# EAGLE design Main (EAGLE 7.4.0)
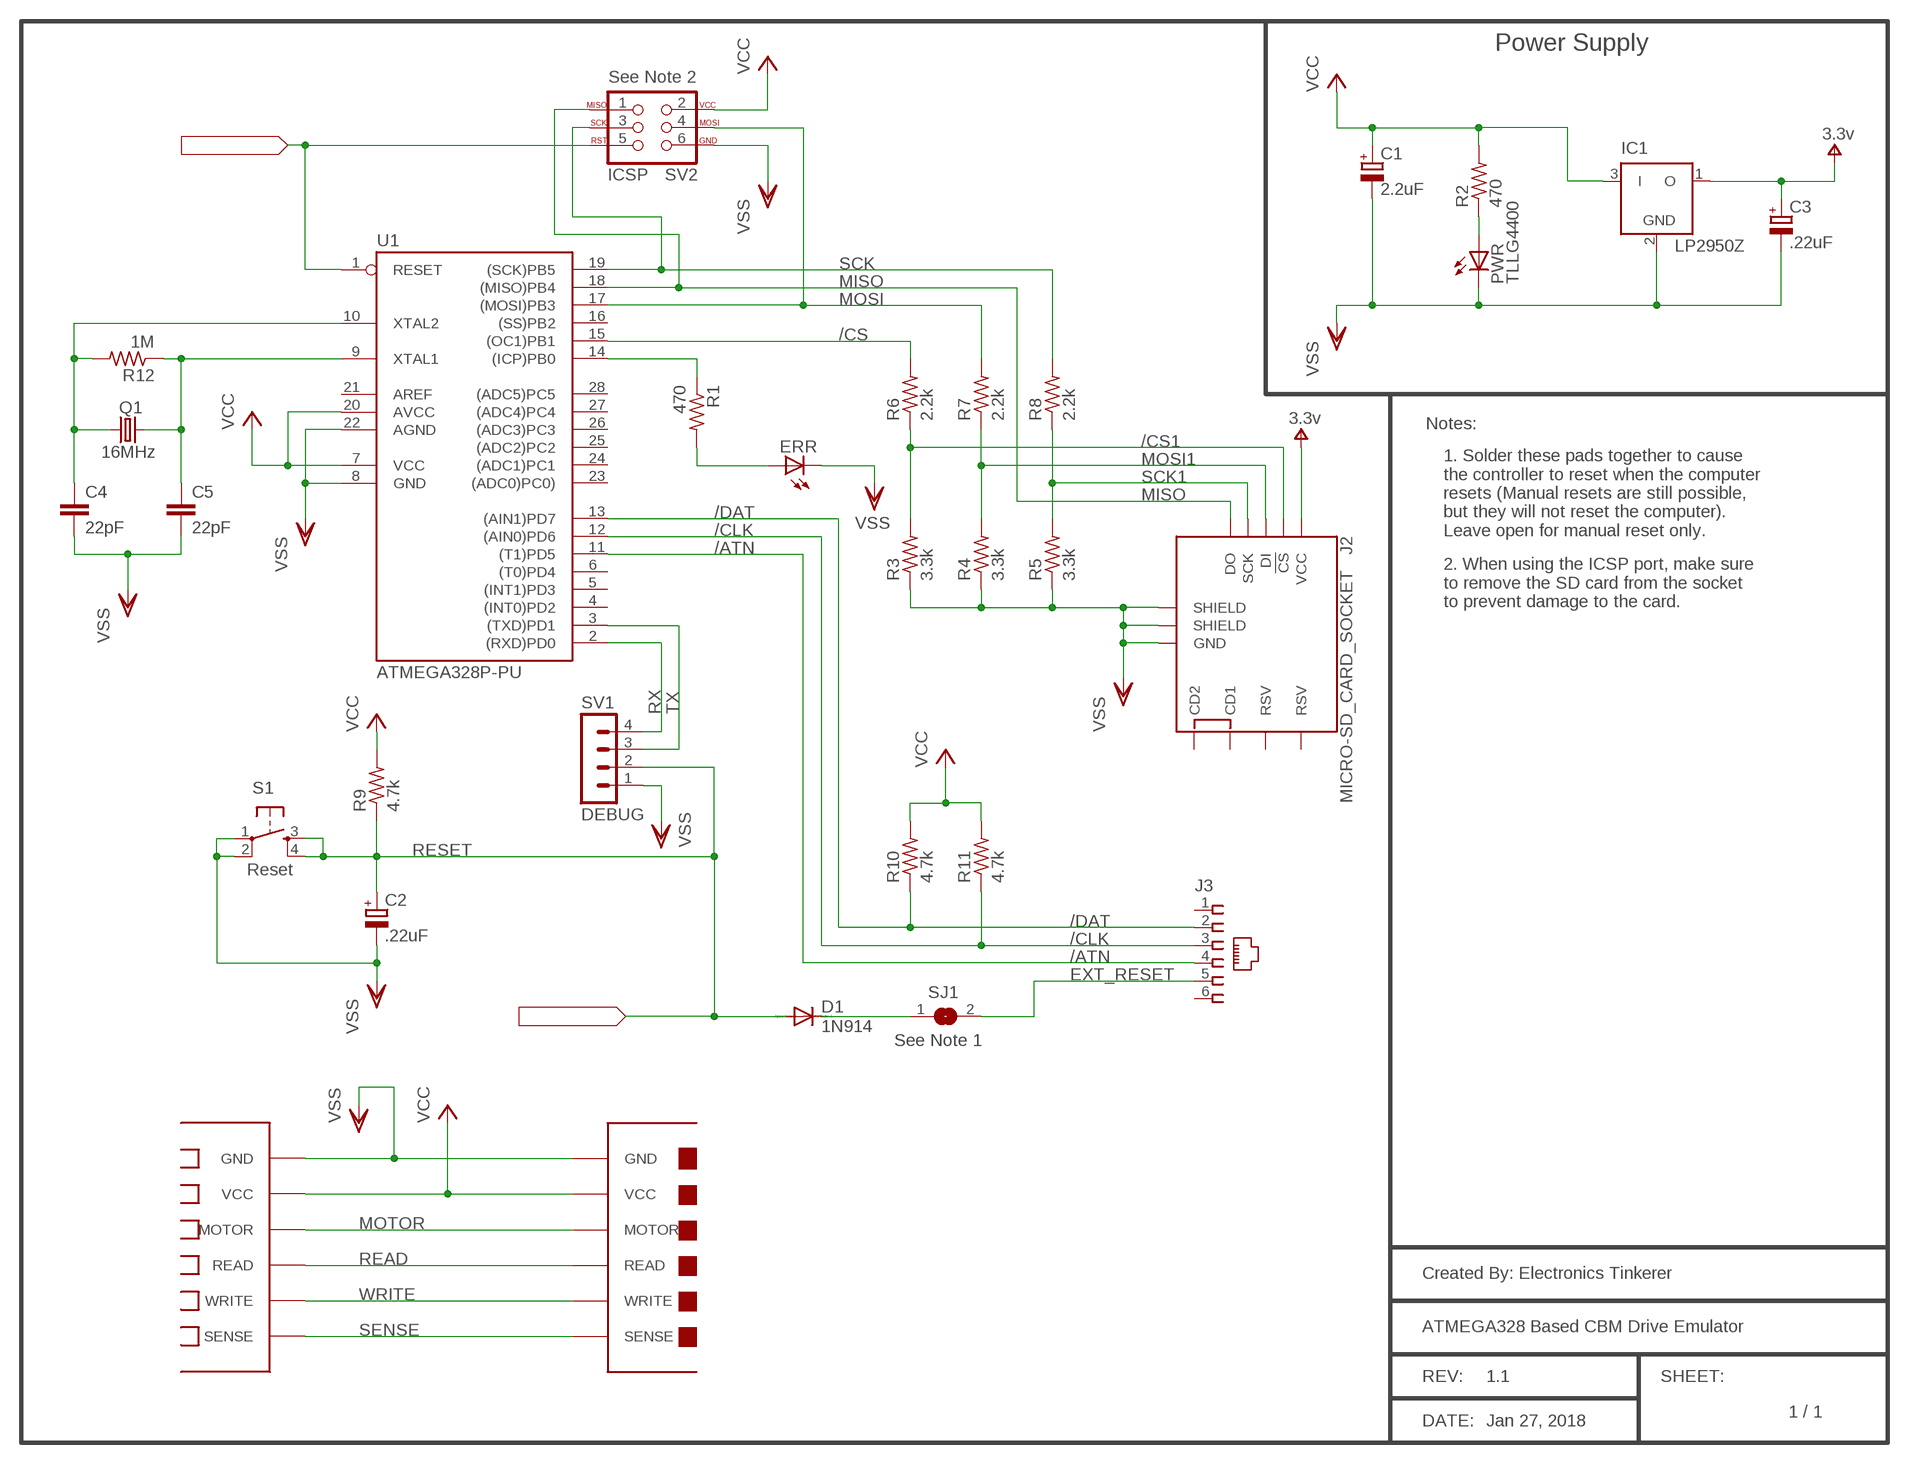
[diagram p0: schematic, sheet 1]
RESET1 (TAG): SIGNAL_NAME: RESET
TAG1 (TAG): SIGNAL_NAME: RESET

## Parts
C1  2.2uF  CPOL-EUE2-5  [E2-5]
C2  .22uF  CPOL-EU  [E1,5-4]
C3  .22uF  CPOL-EU  [E1,5-4]
C4  22pF  C-EU050-024X044  [C050-024X044]
C5  22pF  C-EU050-024X044  [C050-024X044]
D1  1N914  [DO41-5]
ERR  TLLR4400  [LED3MM]
IC1  LP2950Z  [TO92]
J2  MICRO-SD_CARD_SOCKET  [MICRO-SD-SOCKET]
J3  520470-3  [520470-3]
PWR  TLLG4400  [LED3MM]
Q1  16MHz  CRYSTALHC49S  [HC49/S]
R1  470  R-US_0204/5  [0204/5]
R2  470  R-US_0204/5  [0204/5]
R3  3.3k  R-US_0204/5  [0204/5]
R4  3.3k  R-US_0204/5  [0204/5]
R5  3.3k  R-US_0204/5  [0204/5]
R6  2.2k  R-US_0204/5  [0204/5]
R7  2.2k  R-US_0204/5  [0204/5]
R8  2.2k  R-US_0204/5  [0204/5]
R9  4.7k  R-US_0204/5  [0204/5]
R10  4.7k  R-US_0204/5  [0204/5]
R11  4.7k  R-US_0204/5  [0204/5]
R12  1M  R-US_0204/5  [0204/5]
S1  DTS-6  [DTS-6]
SJ1  SJ  [SJ]
SV1  DEBUG  MA04-1  [MA04-1]
SV2  AVR_SPI_PROG  AVR_SPI_PROG_3X2PTH  [2X3]
U1  ATMEGA328P-PU  [DIL28-3]
U$1  CASSETT-BOARDCEC-6  [SOLDER-PADS_3,96-M]
U$2  CASSETT-CON  [SOLDER-PADS_3,96-F]

## Nets
/ATN: J3.4 U1.11((T1)PD5)
/CLK: J3.3 R11.1 U1.12((AIN0)PD6)
/CS: R6.2 U1.15((OC1)PB1)
/CS1: J2.CS(!CS) R3.2 R6.1
/DAT: J3.2 R10.1 U1.13((AIN1)PD7)
EXT_RESET: J3.5 SJ1.2
MISO: J2.DO SV2.1 U1.18((MISO)PB4)
MOSI: R7.2 SV2.4 U1.17((MOSI)PB3)
MOSI1: J2.DI R4.2 R7.1
MOTOR: U$1.MOTOR U$2.MOTOR
N$1: R1.1 U1.14((ICP)PB0)
N$2: PWR.A R2.1
N$3: ERR.A R1.2
N$4: D1.C SJ1.1
N$5: C4.1 Q1.1 R12.2 U1.10(XTAL2)
N$8: C5.1 Q1.2 R12.1 U1.9(XTAL1)
READ: U$1.READ U$2.READ
RESET: C2.+ D1.A R9.1 S1.3 S1.4 SV1.2 SV2.5 U1.1(RESET)
RX: SV1.4 U1.2((RXD)PD0)
SCK: R8.2 SV2.3 U1.19((SCK)PB5)
SCK1: J2.SCLK(SCK) R5.2 R8.1
SENSE: U$1.SENSE U$2.SENSE
TX: SV1.3 U1.3((TXD)PD1)
V+: C3.+ IC1.1(O) J2.VCC
VCC: C1.+ IC1.3(I) R2.2 R9.2 R10.2 R11.2 SV2.2 U1.7(VCC) U1.20(AVCC) U$1.VCC U$2.VCC
VSS: C1.- C2.- C3.- C4.2 C5.2 ERR.K(C) IC1.2(GND) J2.GND J2.GND1(SHIELD) J2.GND3(SHIELD) PWR.K(C) R3.1 R4.1 R5.1 S1.1 S1.2 SV1.1 SV2.6 U1.8(GND) U1.22(AGND) U$1.GND U$2.GND
WRITE: U$1.WRITE U$2.WRITE
Unconnected: J2.CD1 J2.CD2 J2.RSV1(RSV) J2.RSV2(RSV) J3.1 J3.6 U1.4((INT0)PD2) U1.5((INT1)PD3) U1.6((T0)PD4) U1.16((SS)PB2) U1.21(AREF) U1.23((ADC0)PC0)) U1.24((ADC1)PC1) U1.25((ADC2)PC2) U1.26((ADC3)PC3) U1.27((ADC4)PC4) U1.28((ADC5)PC5)

## Notes on the sheet
- Power Supply
- See Note 2
- Notes:
- 1. Solder these pads together to cause 
  the controller to reset when the computer
  resets (Manual resets are still possible, 
  but they will not reset the computer). 
  Leave open for manual reset only.
- 2. When using the ICSP port, make sure
  to remove the SD card from the socket
  to prevent damage to the card.
- See Note 1
- Created By: Electronics Tinkerer
- ATMEGA328 Based CBM Drive Emulator
- REV: | 1.1 | SHEET:
- 1 / 1
- DATE: | Jan 27, 2018

## Library data of the parts
C1-C3 = resistor:CPOL-EU: POLARIZED CAPACITOR, European symbol
C4 C5 = resistor:C-EU: CAPACITOR, European symbol
D1 = diode:1N914: DIODE general purpose rectifier, 1 A
ERR = led:TLLR4400: Low Current (2mA) LED 3 mm Tinted Diffused Package color RED Source: Data sheet <http://www.farnell.com/datasheets/391100.pdf>; MF: VISHAY SEMICONDUCTOR; OC_FARNELL: 1612437
IC1 = linear:LP2950: 100 mA, Low Power Low Dropout Voltage Regulator Source: http://www.onsemi.com/pub/Collateral/LP2950-D.PDF
J2 = SparkFun-Connectors:MICRO-SD_CARD_SOCKET: microSD Socket for Transflash Push-push type µSD socket. tDoc lines correctly indicate media card edge positions when inserting (unlocked, locked, depressed). NOTE: CD1 and CD2 are connected internally, and the default detect state of the socket is detect pin to ground. SparkFun Products: WAV Trigger <https://www.sparkfun.com/products/13660> CAN-Bus Shield <https://www.sparkfun.com/products/13262> SparkFun Level Shifing microSD Breakout <https://www.sparkfun.com/products/13743>; PROD_ID: CONN-07820; SF_ID: PRT-00127
J3 = con-amp:520470-3: AMP connector
PWR = led:TLLG4400: Low Current (2mA) LED 3 mm Tinted Diffused Package color GREEN Source: Data sheet <http://www.farnell.com/datasheets/391098.pdf>; MF: VISHAY SEMICONDUCTOR; OC_FARNELL: 1612435
Q1 = crystal:CRYSTAL: CRYSTAL; OC_FARNELL: 1667008; OC_NEWARK: unknown
R1-R12 = resistor:R-US_: RESISTOR, American symbol
S1 = switch-tact:DTS-6; DESIGNATOR: Reset
SJ1 = jumper:SJ: SMD solder JUMPER
SV1 = con-lstb:MA04-1: PIN HEADER; OC_FARNELL: unknown; OC_NEWARK: unknown
SV2 = SparkFun-Connectors:AVR_SPI_PROG_3X2: AVR ISP 6 Pin This is the reduced ISP connector for AVR programming. Common on Arduino. This footprint will take up less PCB space and can be used with a 10-pin to 6-pin adapter such as SKU: BOB-08508 **Special note about "TEST_POINT" package. The stop mask is on the top side, so if you want your programming test points to be on the bottom of your board, make sure to place this package on the bottom side of the board. This also ensure that the orientation to program from the bottom side will be correct. SparkFun Products: SparkFun ISP Pogo Adapter <https://www.sparkfun.com/products/11591> - NS Tiny AVR Programmer <https://www.sparkfun.com/products/11801> -PTH; TYPE: ICSP
U1 = SmartPrj:ATMEGA328P-: MICROCONTROLLER 4 Kbytes FLASH 128 bytes SRAM 256 bytes EEPROM UART 6-channel 10 bit ADC
U$1 = c64Drive-Connectors:CASSETT-BOARD
U$2 = c64Drive-Connectors:CASSETT-CON

## Board
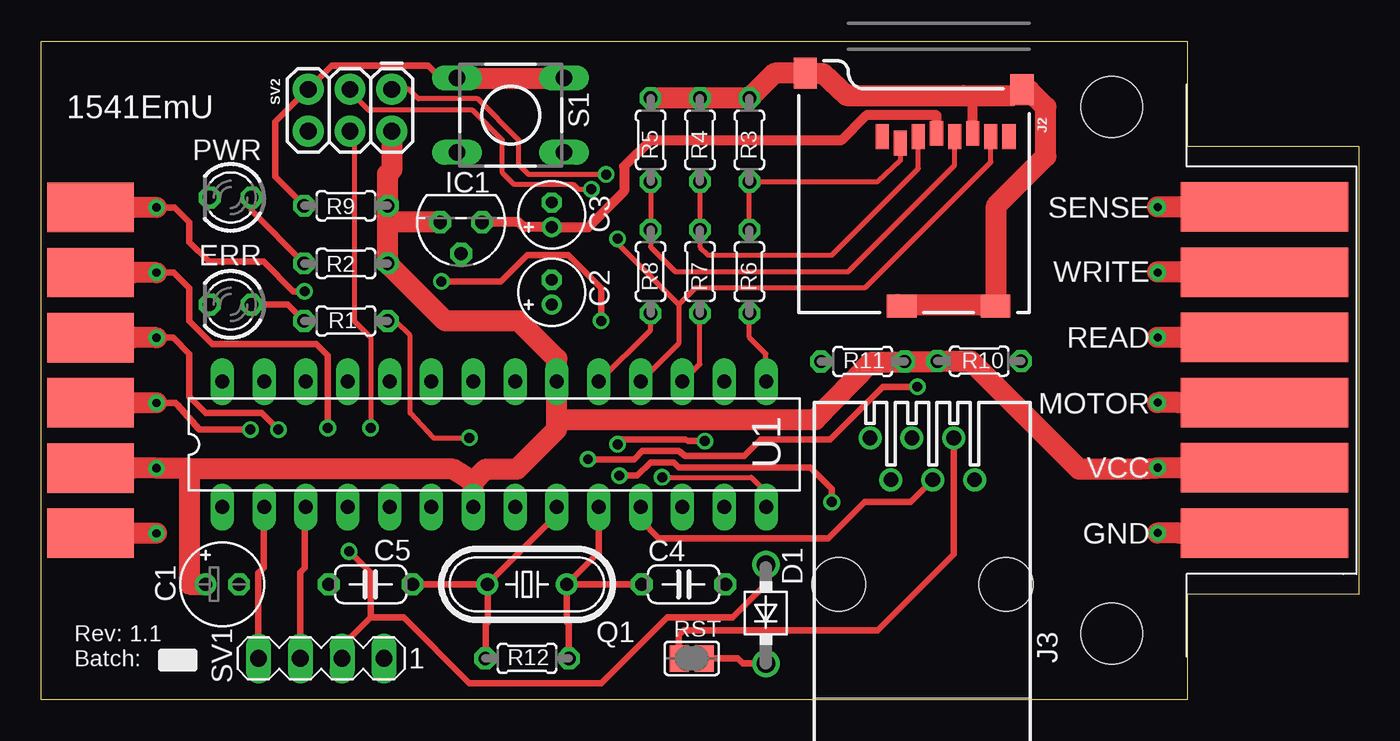
[diagram p1: board, top side]
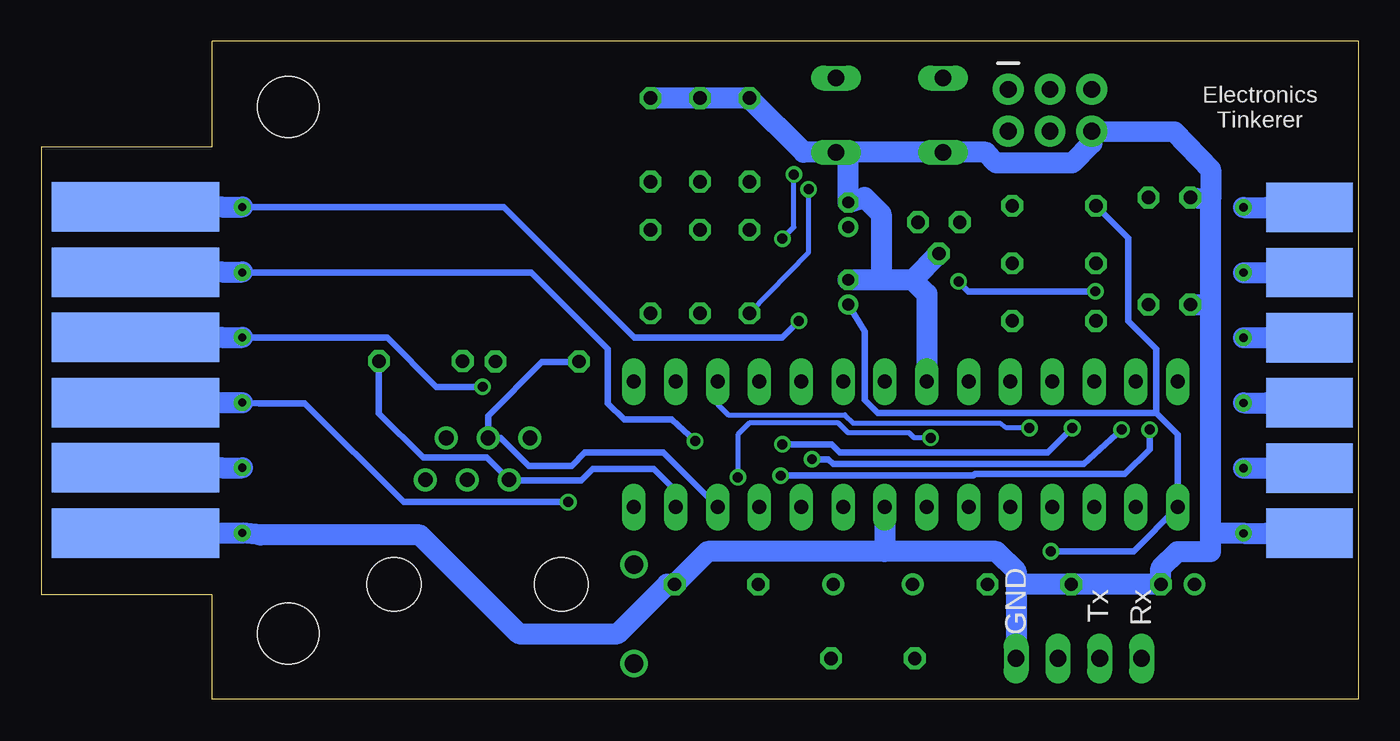
[diagram p2: board, bottom side, seen from below]

Size 80 x 40 mm. Coordinates in mm from the lower left corner, seen from the top.
Outline: 0,0 69.6,0 69.6,6.4 80,6.4 80,33.6 69.6,33.6 69.6,40 0,40 0,0
Copper layers (1*16): Top 0.035mm / dielectric 1.5mm / Bottom 0.035mm
Design rules "default *": minimum track width 10mil, minimum drill 0.4mm, track to track 6mil, track to pad 6mil, pad to pad 6mil, via to via 6mil, smd to smd 6mil, copper to edge 20mil, drill to drill 8mil, minimum pad ring 10mil, minimum via ring 8mil, stop-mask expansion 6mil, vias tented up to drill 0mil, thermal gap 10mil
Holes 3.7 mm at 65,4 65,36

### Footprints (pad centres in the part's own frame; a part is rotated, then mirrored left to right if it is on the bottom)
E2-5 = drill 0.813 pad 1.27: + -1.016,0 | drill 0.813 pad 1.27 octagon: - 1.016,0
E1,5-4 = drill 0.711 pad 1.168: + 0,0 | drill 0.711 pad 1.168 octagon: - 1.5,0
C050-024X044 = drill 0.813 octagon: 1 -2.54,0; 2 2.54,0
DO41-5 = drill 1.118: A 2.19,0; C -3.81,0
LED3MM = drill 0.813 octagon: A -1.27,0; K 1.27,0
TO92 = drill 0.813 octagon: 1 -1.27,0; 2 0,1.905; 3 1.27,0
MICRO-SD-SOCKET = smd 1.8 x 1.4: CD1 -2.05,0.4; CD2 -7.75,0.4 | smd 0.8 x 1.5: CS -7.84,10.3; DI -6.74,10.7; DO -2.34,10.7; GND -3.44,10.9; RSV1 -8.94,10.7; RSV2 -1.24,10.7; SCLK -4.54,10.7; VCC -5.64,10.9 | smd 1.4 x 1.9: GND1 -13.6,14.55; GND3 -0.45,13.55
520470-3 = drill 0.889: 1 -3.175,8.89; 2 -1.905,6.35; 3 -0.635,8.89; 4 0.635,6.35; 5 1.905,8.89; 6 3.175,6.35 | hole 3.251: -5.08,0; 5.08,0
HC49/S = drill 0.813: 1 -2.413,0; 2 2.413,0
0204/5 = drill 0.813 octagon: 1 -2.54,0; 2 2.54,0
DTS-6 = drill 1 long: 1 -3.25,2.25; 2 3.25,2.25; 3 -3.25,-2.25; 4 3.25,-2.25
SJ = smd 1.168 x 1.6: 1 -0.762,0; 2 0.762,0
MA04-1 = drill 1.016 long: 1 -3.81,0; 2 -1.27,0; 3 1.27,0; 4 3.81,0
2X3 = drill 1.016 pad 1.88: 1 0,0; 2 0,2.54; 3 2.54,0; 4 2.54,2.54; 5 5.08,0; 6 5.08,2.54
DIL28-3 = drill 0.85 pad 1.422 long: 1 -16.51,-3.81; 2 -13.97,-3.81; 3 -11.43,-3.81; 4 -8.89,-3.81; 5 -6.35,-3.81; 6 -3.81,-3.81; 7 -1.27,-3.81; 8 1.27,-3.81; 9 3.81,-3.81; 10 6.35,-3.81; 11 8.89,-3.81; 12 11.43,-3.81; 13 13.97,-3.81; 14 16.51,-3.81; 15 16.51,3.81; 16 13.97,3.81; 17 11.43,3.81; 18 8.89,3.81; 19 6.35,3.81; 20 3.81,3.81; 21 1.27,3.81; 22 -1.27,3.81; 23 -3.81,3.81; 24 -6.35,3.81; 25 -8.89,3.81; 26 -11.43,3.81; 27 -13.97,3.81; 28 -16.51,3.81
SOLDER-PADS_3,96-M = drill 0.5: GND -0.01,8.85; MOTOR -0.01,16.77; READ -0.01,20.73; SENSE -0.01,28.65; VCC -0.01,12.81; WRITE -0.01,24.67 | smd 10.16 x 3: P$1 6.477,28.65; P$8 6.477,24.69; P$9 6.477,20.73; P$10 6.477,16.77; P$11 6.477,12.81; P$12 6.477,8.85 | smd 10.16 x 3 bottom: P$2 6.477,24.69; P$3 6.477,20.73; P$4 6.477,16.77; P$5 6.477,12.81; P$6 6.477,8.85; P$7 6.477,28.65
SOLDER-PADS_3,96-F = drill 0.5: GND 4,3; MOTOR 4,10.92; READ 4,14.88; SENSE 4,22.8; VCC 4,6.96; WRITE 4,18.84 | smd 5.25 x 3 bottom: P$1 0,3; P$2 0,6.96; P$3 0,10.92; P$4 0,14.88; P$6 0,22.8; P$11 0,18.84 | smd 5.25 x 3: P$5 0,18.84; P$7 0,3; P$8 0,6.96; P$9 0,10.92; P$10 0,14.88; P$12 0,22.8

### Placement (x,y rotation side)
C1  11,7 0 top
C2  31,24 90 top
C3  31,28.7 90 top
C4  39,7 0 top
C5  20,7 180 top
D1  44,6 90 top
ERR  11.5,24 180 top
IC1  25.5,29 180 top
J2  60,23.5 0 top
J3  53.5,7 0 top
PWR  11.5,30.5 180 top
Q1  29.5,7 180 top
R1  18.5,23 180 top
R2  18.5,26.5 0 top
R3  43,34 270 top
R4  40,34 270 top
R5  37,34 270 top
R6  43,26 270 top
R7  40,26 270 top
R8  37,26 270 top
R9  18.5,30 0 top
R10  56.95,20.56 180 top
R11  49.88,20.54 0 top
R12  29.5,2.5 0 top
S1  28.5,35.5 180 top
SJ1  39.5,2.5 180 top
SV1  17,2.5 180 top
SV2  21.29,37.07 180 top
U1  27.5,15.5 0 top
U$1  67.8,1.27 0 top
U$2  3,7.1 0 top

### Tracks (layer width: path | path; a pad name or v marks a point on that pad's centre or on a via)
/ATN
  Top 0.406: J3.4 52.78,12 50,12 47.8,9.8 37.5,9.8 36.39,10.91 U1.11
/CLK
  Bottom 0.406: R11.1 47.38,20.5 49.6,20.5 52.87,17.23 J3.3 52.09,15.89 50.4,14.2 47.8,14.2 47,15 42.24,15 U1.12
/CS
  Top 0.305: U1.15 44,21 43,22 R6.2
/CS1
  Top 0.305: R6.1 R3.2 50.76,31.46 52.16,32.76 J2.CS
/DAT
  Bottom 0.406: R10.1 59.49,17.39 56.8,14.7 52.95,14.7 J3.2 51.55,13.3 47.2,13.3 46.5,14 42.8,14 41.47,12.67 U1.13
EXT_RESET
  Top 0.406: SJ1.2 38.7,2.54 38.7,3.9 39,4.2 50.8,4.2 55.41,8.8 J3.5
MISO  (via drill 0.6)
  Top 0.305: U1.18 38.7,21.62 38.7,24 | J2.DO 57.66,32.66 50,25 39.7,25 38.7,24 | v35,28 35,27.7 38.7,24 | v34.3,31.9 29.6,31.9 29,32.5 29,34 26.5,36.5 22.9,36.5 22.33,37.07 SV2.1
  Bottom 0.305: v35,28 34.3,28.7 v34.3,31.9
MOSI  (via drill 0.6)
  Top 0.305: U1.17 40,20.38 R7.2 | SV2.4 19,34.28 19,23 20,22 v20,16.5
  Bottom 0.305: v20,16.5 21.4,16.5 21.8,16.8 30.7,16.8 31.2,17.3 38.3,17.3 38.93,17.93 U1.17
MOSI1
  Top 0.305: R7.1 R4.2 40,27.5 40.5,27 48,27 53.26,32.26 J2.DI
MOTOR  (via drill 0.6)
  Top 0.406: v35.1,13.6 36.2,13.6 37,14.4 38.4,14.4 38.7,14.1 46.7,14.1 48,12.8 v48,12 | v12.7,16.4 9.6,16.4 8.28,17.93 8.18,18.02 U$2.MOTOR
  Bottom 0.406: v35.1,13.6 23.4,13.6 23.3,13.7 14.2,13.7 12.7,15.2 v12.7,16.4 | v48,12 58,12 64,18 66.75,18 U$1.MOTOR
N$1  (via drill 0.6)
  Top 0.305: R1.1 21.5,23 22.4,22.1 22.4,17.4 23.8,15.9 v26,15.9 | v37.7,13.5 43.1,13.5 44.01,12.59 U1.14
  Bottom 0.305: v26,15.9 27,15.9 27.3,16.2 31,16.2 31.6,16.8 37,16.8 37.7,16.1 v37.7,13.5
N$2
  Top 0.406: R2.1 12.77,29.69 PWR.A
N$3
  Top 0.406: R1.2 14.96,24 ERR.A
N$4
  Top 0.406: D1.C 42.6,2.2 42.3,2.5 SJ1.1
N$5
  Top 0.406: Q1.1 33.85,8.94 U1.10 | Q1.1 C4.1 | Q1.1 32.04,6.87 | R12.2 32.04,4.56 31.9,4.7 31.9,6.99 Q1.1
N$6
  Top 1.27: 52,24 58,24 58,30 61,33 61,36 60,37
N$8
  Top 0.406: U1.9 31.31,11.22 Q1.2 | Q1.2 C5.1 | R12.1 27,2.5 27,4.6 27.1,4.7 27.1,6.99 Q1.2
READ  (via drill 0.6)
  Top 0.406: v33.2,14.6 36,14.6 36.5,15.1 38.7,15.1 39.1,14.8 42.7,14.8 43.7,15.8 47.9,15.8 51.1,19 v53.2,19 | v14.4,16.4 13.4,17.4 10,17.4 9,18.4 9,21 8.02,21.98 U$2.READ
  Bottom 0.406: v14.4,16.4 16.7,14.3 31.9,14.3 32.2,14.6 v33.2,14.6 | v53.2,19 56,19 59,22 U$1.READ
RESET  (via drill 0.6)
  Top 0.406: 20,5 22,5 26,1 34,1 38,5 42,5 44,7 D1.A | 20,5 18,3 18.27,2.73 SV1.2 | v18.7,9 20,7.7 20,5 | R9.1 14.2,31.76 14.2,35.1 15.77,36.67 SV2.5 17.64,38.5 23.5,38.5 24.25,37.75 S1.4
  Top 1.27: S1.4 S1.3
  Bottom 0.406: v18.7,9 13.68,9 U1.1 10.99,16.09 12.3,17.4 | C2.+ 30,22.36 30,18.2 29.2,17.4 12.3,17.4 | R9.1 14,28.04 14,23 12.3,21.3 12.3,17.4
RX
  Top 0.406: U1.2 13.5,11.66 13.5,8 13.19,7.69 SV1.4
SCK  (via drill 0.6)
  Top 0.305: U1.19 37,22.46 R8.2 | SV2.3 18.75,36.95 19.9,35.8 26.2,35.8 28,34 28,32 28.7,31.3 32.3,31.3 32.6,31 v33.4,31
  Bottom 0.305: R8.2 33.4,27.16 v33.4,31
SCK1
  Top 0.305: R8.1 R5.2 37,27.5 38.5,26 49,26 55.46,32.46 J2.SCLK
SENSE  (via drill 0.6)
  Top 0.406: v16,24.8 15.3,24.8 13.5,26.6 10.2,26.6 9,27.8 9,29 8.1,29.9 U$2.SENSE | v24.3,25.4 27.9,25.4 29.5,27 32,27 34,25 v34,23
  Bottom 0.406: v16,24.8 23.7,24.8 v24.3,25.4 | v34,23 35,22 44,22 51.92,29.92 U$1.SENSE
TX
  Top 0.406: U1.3 16,11.62 16,8 15.73,7.73 SV1.3
V+
  Top 0.61: J2.VCC 54.36,35.5 50.1,35.5 48.6,34 37,34 35.4,32.4 35.4,30.9 33.2,28.7 C3.+ 29.3,28.7 29,29 IC1.1
VCC
  Top 1.27: 9,14 9,7 C1.+ | 26.23,13.23 25,14 9,14 | U1.7 26.23,13.23 | 26.23,13.23 27,14 28.9,14 31.3,16.4 31.3,17 | 31.3,17 U1.20 31.31,20.69 29,23 24.54,23 R2.2 21.04,29 | 31.3,17 47,17 50.4,20.5 52.28,20.5 R11.2 54.39,20.54 R10.2 56.44,20.56 63,14 66.71,14 U$1.VCC | 21.04,29 R9.2 21.04,31.94 21.3,32.2 SV2.2 | IC1.3 21.04,29 | U$2.VCC 8.94,14.06 9,14
VSS
  Top 0.61: J2.GND 56.56,36.14 56,36.7
  Top 1.27: 37.1,36.5 37.14,36.54 R3.1 44.51,38.05 J2.GND1 47.45,38.05 48.9,36.7 56,36.7 59,36.7 J2.GND3
  Bottom 1.27: 9,10 9,9 11,9 12.02,7.98 C1.- C5.2 20.81,7 | 9,10 9,24 | 9,24 9,30.4 | PWR.K 9,30.4 | ERR.K 9,24 | 9,30.4 9,32.2 11.2,34.5 SV2.6 16.2,33.8 17.4,32.6 22,32.6 22.65,33.25 S1.2 31,33.25 | 20.81,7 SV1.1 | U1.8 28.77,10.23 28.8,9 | 28.8,9 22,9 20.81,7.81 20.81,7 | 28.8,9 39.54,9 C4.2 | C4.2 41.6,7 | 31,33.25 S1.1 33.71,33.25 R5.1 R4.1 R3.1 | 31,33.25 C3.- 30,30.5 29,29.5 29,25.5 | C4.2 42,7 45,4 51,4 57,10 66.67,10 U$1.GND | IC1.2 27.09,25.5 | 27.09,25.5 29,25.5 | 29,25.5 C2.- | 27.09,25.5 26.23,24.64 U1.22 | U$2.GND 8.9,10.1 arc-90 9,10
WRITE  (via drill 0.6)
  Top 0.406: v17.4,16.5 17.4,20.9 16.7,21.6 10.4,21.6 9,23 9,25 8.06,25.94 U$2.WRITE | v35,15.5 35.3,15.8 39.1,15.8 39.3,15.7 v40.3,15.7
  Bottom 0.406: v17.4,16.5 18.9,15 31.5,15 32,15.5 v35,15.5 | v40.3,15.7 41.7,17 44.6,17 45.6,18 45.6,21.3 50.24,25.94 U$1.WRITE

### Text on the board
tPlace: 1541EmU | SENSE | WRITE | READ | MOTOR | VCC | GND | RST | Rev: 1.1 / Batch:
bPlace: Electronics / Tinkerer | GND | Rx | Tx